# Altium schematic sheet AHK50H-ND_THERM_CONNECTOR.SchDoc
size A
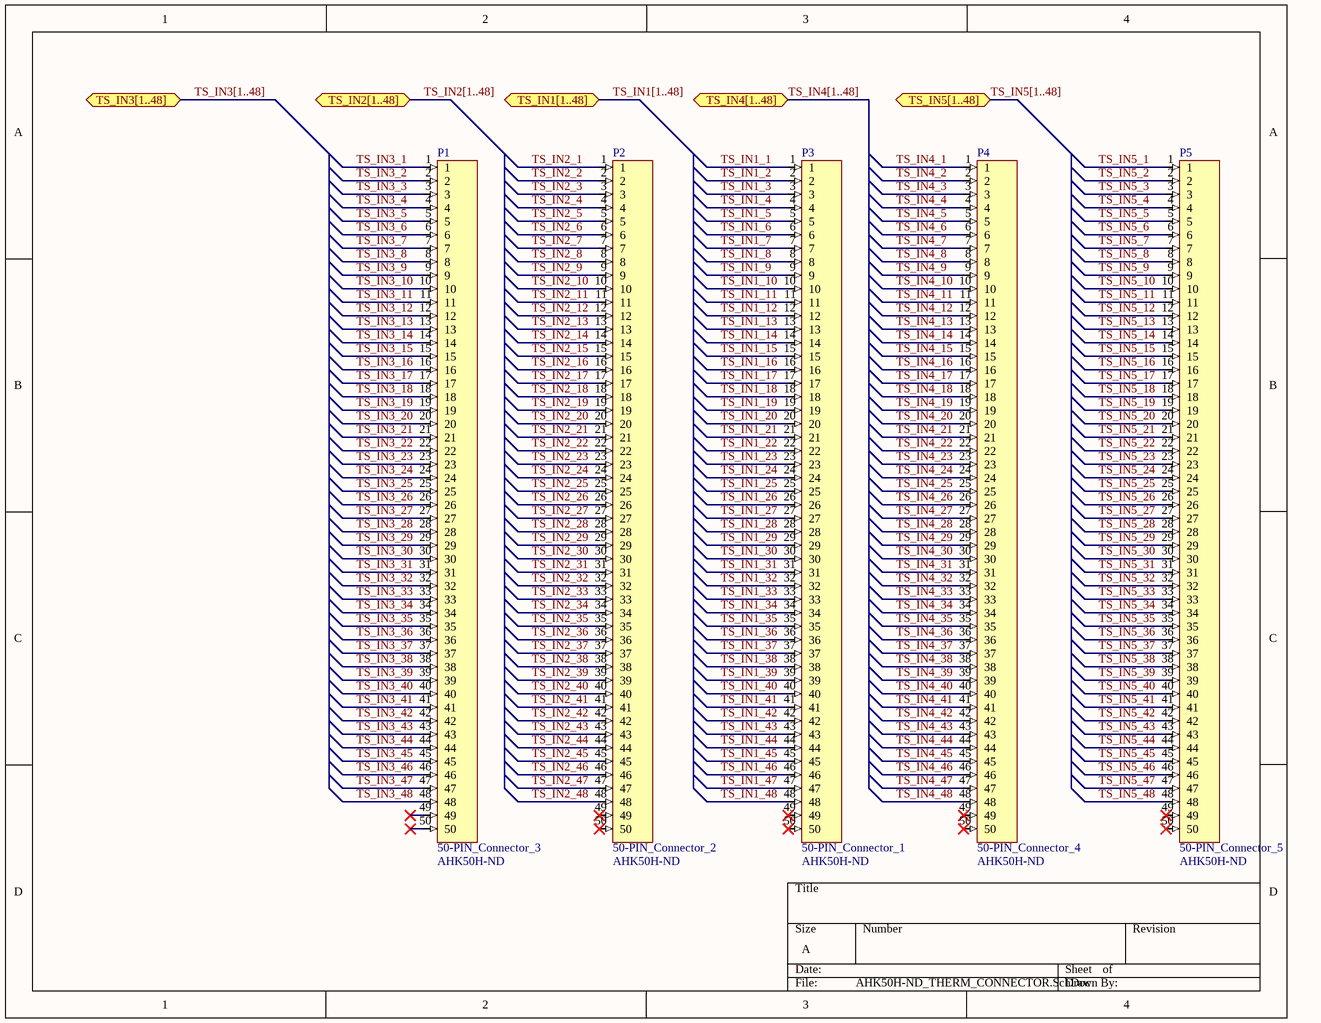
[diagram p0: AHK50H-ND_THERM_CONNECTOR.SchDoc]

## Parts
P1  50-PIN_Connector_3  Supplier Part Number 1: AHK50H-ND  [50_Pin_Connector]
P2  50-PIN_Connector_2  Supplier Part Number 1: AHK50H-ND  [50_Pin_Connector]
P3  50-PIN_Connector_1  Supplier Part Number 1: AHK50H-ND  [50_Pin_Connector]
P4  50-PIN_Connector_4  Supplier Part Number 1: AHK50H-ND  [50_Pin_Connector]
P5  50-PIN_Connector_5  Supplier Part Number 1: AHK50H-ND  [50_Pin_Connector]

## Ports
TS_IN1[1..48] (bidir), TS_IN2[1..48] (bidir), TS_IN3[1..48] (bidir), TS_IN4[1..48] (bidir), TS_IN5[1..48] (bidir)

## Nets
TS_IN1_1: P3.1
TS_IN1_2: P3.2
TS_IN1_3: P3.3
TS_IN1_4: P3.4
TS_IN1_5: P3.5
TS_IN1_6: P3.6
TS_IN1_7: P3.7
TS_IN1_8: P3.8
TS_IN1_9: P3.9
TS_IN1_10: P3.10
TS_IN1_11: P3.11
TS_IN1_12: P3.12
TS_IN1_13: P3.13
TS_IN1_14: P3.14
TS_IN1_15: P3.15
TS_IN1_16: P3.16
TS_IN1_17: P3.17
TS_IN1_18: P3.18
TS_IN1_19: P3.19
TS_IN1_20: P3.20
TS_IN1_21: P3.21
TS_IN1_22: P3.22
TS_IN1_23: P3.23
TS_IN1_24: P3.24
TS_IN1_25: P3.25
TS_IN1_26: P3.26
TS_IN1_27: P3.27
TS_IN1_28: P3.28
TS_IN1_29: P3.29
TS_IN1_30: P3.30
TS_IN1_31: P3.31
TS_IN1_32: P3.32
TS_IN1_33: P3.33
TS_IN1_34: P3.34
TS_IN1_35: P3.35
TS_IN1_36: P3.36
TS_IN1_37: P3.37
TS_IN1_38: P3.38
TS_IN1_39: P3.39
TS_IN1_40: P3.40
TS_IN1_41: P3.41
TS_IN1_42: P3.42
TS_IN1_43: P3.43
TS_IN1_44: P3.44
TS_IN1_45: P3.45
TS_IN1_46: P3.46
TS_IN1_47: P3.47
TS_IN1_48: P3.48
TS_IN2_1: P2.1
TS_IN2_2: P2.2
TS_IN2_3: P2.3
TS_IN2_4: P2.4
TS_IN2_5: P2.5
TS_IN2_6: P2.6
TS_IN2_7: P2.7
TS_IN2_8: P2.8
TS_IN2_9: P2.9
TS_IN2_10: P2.10
TS_IN2_11: P2.11
TS_IN2_12: P2.12
TS_IN2_13: P2.13
TS_IN2_14: P2.14
TS_IN2_15: P2.15
TS_IN2_16: P2.16
TS_IN2_17: P2.17
TS_IN2_18: P2.18
TS_IN2_19: P2.19
TS_IN2_20: P2.20
TS_IN2_21: P2.21
TS_IN2_22: P2.22
TS_IN2_23: P2.23
TS_IN2_24: P2.24
TS_IN2_25: P2.25
TS_IN2_26: P2.26
TS_IN2_27: P2.27
TS_IN2_28: P2.28
TS_IN2_29: P2.29
TS_IN2_30: P2.30
TS_IN2_31: P2.31
TS_IN2_32: P2.32
TS_IN2_33: P2.33
TS_IN2_34: P2.34
TS_IN2_35: P2.35
TS_IN2_36: P2.36
TS_IN2_37: P2.37
TS_IN2_38: P2.38
TS_IN2_39: P2.39
TS_IN2_40: P2.40
TS_IN2_41: P2.41
TS_IN2_42: P2.42
TS_IN2_43: P2.43
TS_IN2_44: P2.44
TS_IN2_45: P2.45
TS_IN2_46: P2.46
TS_IN2_47: P2.47
TS_IN2_48: P2.48
TS_IN3_1: P1.1
TS_IN3_2: P1.2
TS_IN3_3: P1.3
TS_IN3_4: P1.4
TS_IN3_5: P1.5
TS_IN3_6: P1.6
TS_IN3_7: P1.7
TS_IN3_8: P1.8
TS_IN3_9: P1.9
TS_IN3_10: P1.10
TS_IN3_11: P1.11
TS_IN3_12: P1.12
TS_IN3_13: P1.13
TS_IN3_14: P1.14
TS_IN3_15: P1.15
TS_IN3_16: P1.16
TS_IN3_17: P1.17
TS_IN3_18: P1.18
TS_IN3_19: P1.19
TS_IN3_20: P1.20
TS_IN3_21: P1.21
TS_IN3_22: P1.22
TS_IN3_23: P1.23
TS_IN3_24: P1.24
TS_IN3_25: P1.25
TS_IN3_26: P1.26
TS_IN3_27: P1.27
TS_IN3_28: P1.28
TS_IN3_29: P1.29
TS_IN3_30: P1.30
TS_IN3_31: P1.31
TS_IN3_32: P1.32
TS_IN3_33: P1.33
TS_IN3_34: P1.34
TS_IN3_35: P1.35
TS_IN3_36: P1.36
TS_IN3_37: P1.37
TS_IN3_38: P1.38
TS_IN3_39: P1.39
TS_IN3_40: P1.40
TS_IN3_41: P1.41
TS_IN3_42: P1.42
TS_IN3_43: P1.43
TS_IN3_44: P1.44
TS_IN3_45: P1.45
TS_IN3_46: P1.46
TS_IN3_47: P1.47
TS_IN3_48: P1.48
TS_IN4_1: P4.1
TS_IN4_2: P4.2
TS_IN4_3: P4.3
TS_IN4_4: P4.4
TS_IN4_5: P4.5
TS_IN4_6: P4.6
TS_IN4_7: P4.7
TS_IN4_8: P4.8
TS_IN4_9: P4.9
TS_IN4_10: P4.10
TS_IN4_11: P4.11
TS_IN4_12: P4.12
TS_IN4_13: P4.13
TS_IN4_14: P4.14
TS_IN4_15: P4.15
TS_IN4_16: P4.16
TS_IN4_17: P4.17
TS_IN4_18: P4.18
TS_IN4_19: P4.19
TS_IN4_20: P4.20
TS_IN4_21: P4.21
TS_IN4_22: P4.22
TS_IN4_23: P4.23
TS_IN4_24: P4.24
TS_IN4_25: P4.25
TS_IN4_26: P4.26
TS_IN4_27: P4.27
TS_IN4_28: P4.28
TS_IN4_29: P4.29
TS_IN4_30: P4.30
TS_IN4_31: P4.31
TS_IN4_32: P4.32
TS_IN4_33: P4.33
TS_IN4_34: P4.34
TS_IN4_35: P4.35
TS_IN4_36: P4.36
TS_IN4_37: P4.37
TS_IN4_38: P4.38
TS_IN4_39: P4.39
TS_IN4_40: P4.40
TS_IN4_41: P4.41
TS_IN4_42: P4.42
TS_IN4_43: P4.43
TS_IN4_44: P4.44
TS_IN4_45: P4.45
TS_IN4_46: P4.46
TS_IN4_47: P4.47
TS_IN4_48: P4.48
TS_IN5_1: P5.1
TS_IN5_2: P5.2
TS_IN5_3: P5.3
TS_IN5_4: P5.4
TS_IN5_5: P5.5
TS_IN5_6: P5.6
TS_IN5_7: P5.7
TS_IN5_8: P5.8
TS_IN5_9: P5.9
TS_IN5_10: P5.10
TS_IN5_11: P5.11
TS_IN5_12: P5.12
TS_IN5_13: P5.13
TS_IN5_14: P5.14
TS_IN5_15: P5.15
TS_IN5_16: P5.16
TS_IN5_17: P5.17
TS_IN5_18: P5.18
TS_IN5_19: P5.19
TS_IN5_20: P5.20
TS_IN5_21: P5.21
TS_IN5_22: P5.22
TS_IN5_23: P5.23
TS_IN5_24: P5.24
TS_IN5_25: P5.25
TS_IN5_26: P5.26
TS_IN5_27: P5.27
TS_IN5_28: P5.28
TS_IN5_29: P5.29
TS_IN5_30: P5.30
TS_IN5_31: P5.31
TS_IN5_32: P5.32
TS_IN5_33: P5.33
TS_IN5_34: P5.34
TS_IN5_35: P5.35
TS_IN5_36: P5.36
TS_IN5_37: P5.37
TS_IN5_38: P5.38
TS_IN5_39: P5.39
TS_IN5_40: P5.40
TS_IN5_41: P5.41
TS_IN5_42: P5.42
TS_IN5_43: P5.43
TS_IN5_44: P5.44
TS_IN5_45: P5.45
TS_IN5_46: P5.46
TS_IN5_47: P5.47
TS_IN5_48: P5.48

Not connected (* = marked no-connect by the designer): P1 49* 50*; P2 49* 50*; P3 49* 50*; P4 49* 50*; P5 49* 50*

## Buses and harness runs
bus TS_IN1[1..48] = port TS_IN1[1..48]
bus TS_IN2[1..48] = port TS_IN2[1..48]
bus TS_IN3[1..48] = port TS_IN3[1..48]
bus TS_IN4[1..48] = port TS_IN4[1..48]
bus TS_IN5[1..48] = port TS_IN5[1..48]

## Library data of the parts
P1-P5 = 50-PIN_Connector: TE_CONN_VERT_50-PIN; Supplier 1: Digi-Key